# EAGLE design driver (EAGLE 6.5.0)

## Sheet 1 of 3
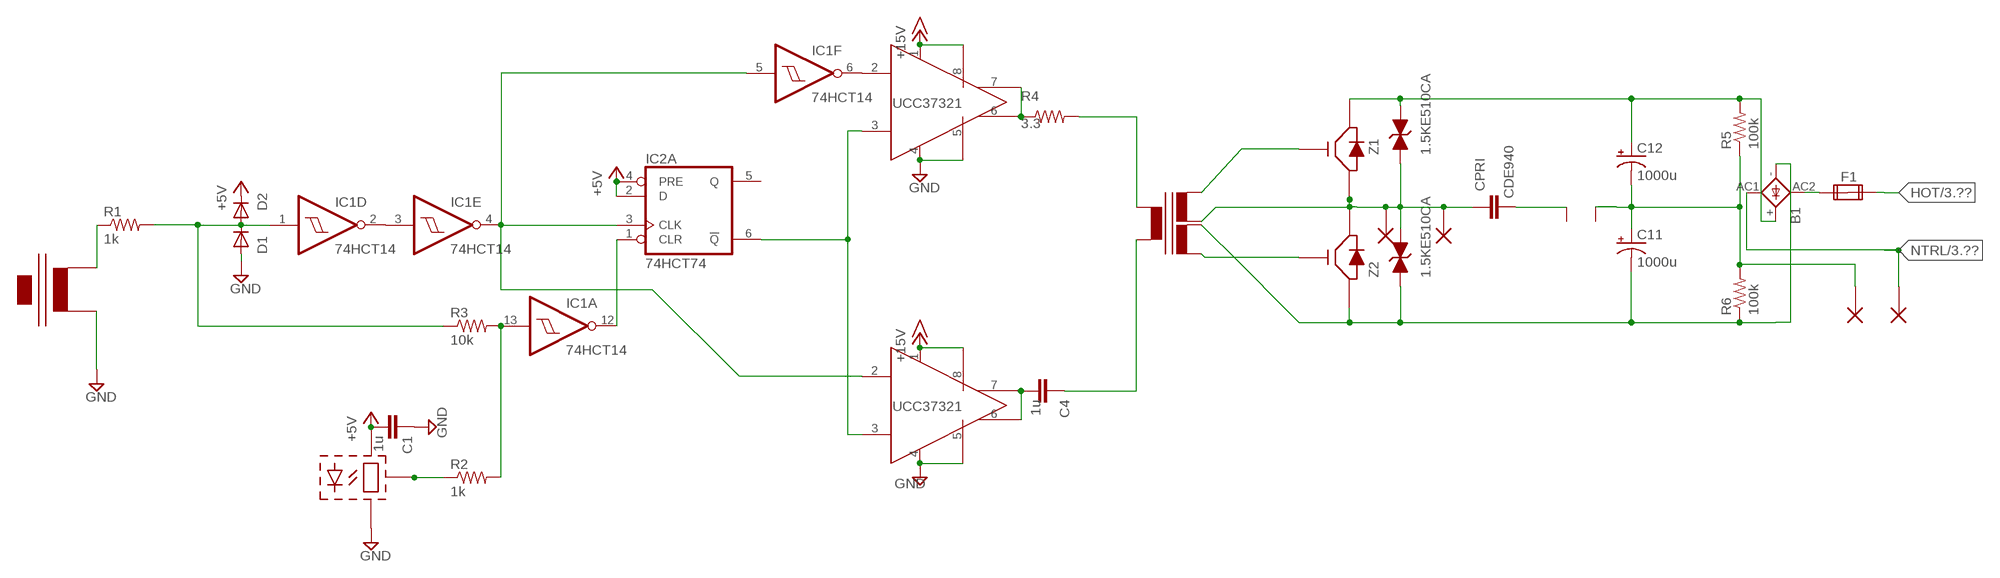
[diagram p0: schematic, sheet 1]

### Parts
B1  GBU4  [GBU4S]
C1  1u  C-EU050-024X044  [C050-024X044@1]
C4  1u  C-EU050-024X044  [C050-024X044@1]
C11  1000u  CPOL-USE10-25  [EB25D]
C12  1000u  CPOL-USE10-25  [EB25D]
CPRI  CDE940  [CDE940]
D1  1N4148DO35-7  [DO35-7]
D2  1N4148DO35-7  [DO35-7]
F1  FUSE2P  [FUSE1]
IC1  74HCT14  74LS14N  [DIL14]
IC2  74HCT74  74LS74N  [DIL14]
IC3  UCC37321DIL8  [DIL08]
IC4  UCC37321DIL8  [DIL08]
P1  12AWG_PAD  [12AWG_PAD]
P2  12AWG_PAD  [12AWG_PAD]
P3  12AWG_PAD  [12AWG_PAD]
P4  12AWG_PAD  [12AWG_PAD]
R1  1k  RES_5W  [0922/22]
R2  1k  R-US_0204/7  [0204/7]
R3  10k  R-US_0204/7  [0204/7]
R4  3.3  R-US_0204/7  [0204/7]
R5  100k  R-US_0309/10  [0309/10]
R6  100k  R-US_0309/10  [0309/10]
T1  P0584  [P0584]
U$2  TRIAD_CT  [CT2]
U$5  2STANDOFFS  [2STANDOFFS]
U$6  IF-D95  [IFD95]
U$7  FGA60N65SMD  [TO247H]
U$8  FGA60N65SMD  [TO247H]
Z1  1.5KE510CA  [DO201]
Z2  1.5KE510CA  [DO201]

### Nets
+5V: C1.2 D2.C IC2.2(A:D) IC2.4(A:PRE) U$6.V+(VCC) ; also sheet 3
+15V: IC3.1(1_VDD) IC3.8(8_VDD) IC4.1(1_VDD) IC4.8(8_VDD) ; also sheet 3
GND: C1.1 D1.A IC3.4(4_AGND) IC3.5(5_PGND) IC4.4(4_AGND) IC4.5(5_PGND) U$2.P$2 U$6.GND ; also sheet 2,3
HOT: F1.2A ; also sheet 3
N: C11.+ C12.- P3.P$1 R5.1 R6.2 U$5.P$1
N$1: R1.1 U$2.P$1
N$2: T1.7(SEC2B) U$8.G
N$3: D1.C D2.A IC1.1(D:I) R1.2 R3.1
N$4: IC1.6(F:O) IC3.2(2_IN)
N$5: IC1.2(D:O) IC1.3(E:I)
N$6: IC1.12(A:O) IC2.1(A:CLR)
N$11: IC3.6(6_OUT) IC3.7(7_OUT) R4.1
N$13: C4.2 IC4.6(6_OUT) IC4.7(7_OUT)
N$14: CPRI.P$1 P1.P$1 P2.P$1 T1.4(SEC1B) U$7.E U$8.C Z1.A Z2.C
N$15: R2.1 U$6.OUT
N$16: IC1.13(A:I) R2.2 R3.2
N$17: B1.AC2(AC1) F1.1A
N$18: T1.3(SEC1A) U$7.G
N$19: IC1.4(E:O) IC1.5(F:I) IC2.3(A:CLK) IC4.2(2_IN)
N$22: CPRI.P$2 U$5.P$2
N$23: R4.2 T1.1(PRIA)
N$24: C4.1 T1.10(PRIB)
N$25: IC2.6(A:!Q) IC3.3(3_ENBL) IC4.3(3_ENBL)
NEG: B1.- C11.- R6.1 T1.8(SEC2A) U$8.E Z2.A
NTRL: B1.AC1(AC2) P4.P$1 ; also sheet 3
POS: B1.+ C12.+ R5.2 U$7.C Z1.C
Unconnected: F1.1B F1.2B IC2.5(A:Q)

## Sheet 2 of 3
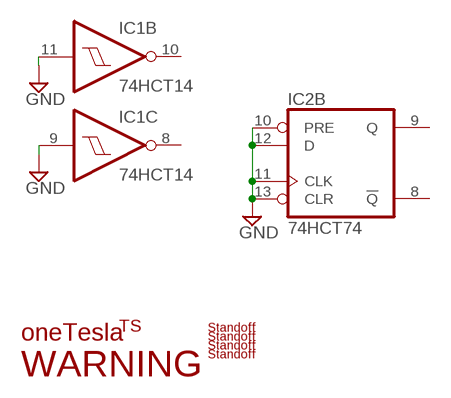
[diagram p1: schematic, sheet 2]

### Parts
U$1  LOGO  [LOGO]
U$3  WARNING  [WARNING]
U$4  TS-LOGO  [TSLOGO]
U$12  STANDOFF-QTR  [STANDOFF]
U$13  STANDOFF-QTR  [STANDOFF]
U$14  STANDOFF-QTR  [STANDOFF]
U$15  STANDOFF-QTR  [STANDOFF]

### Nets
GND: IC1.9(C:I) IC1.11(B:I) IC2.10(B:PRE) IC2.11(B:CLK) IC2.12(B:D) IC2.13(B:CLR) ; also sheet 1,3
Unconnected: IC1.8(C:O) IC1.10(B:O) IC2.8(B:!Q) IC2.9(B:Q)

## Sheet 3 of 3
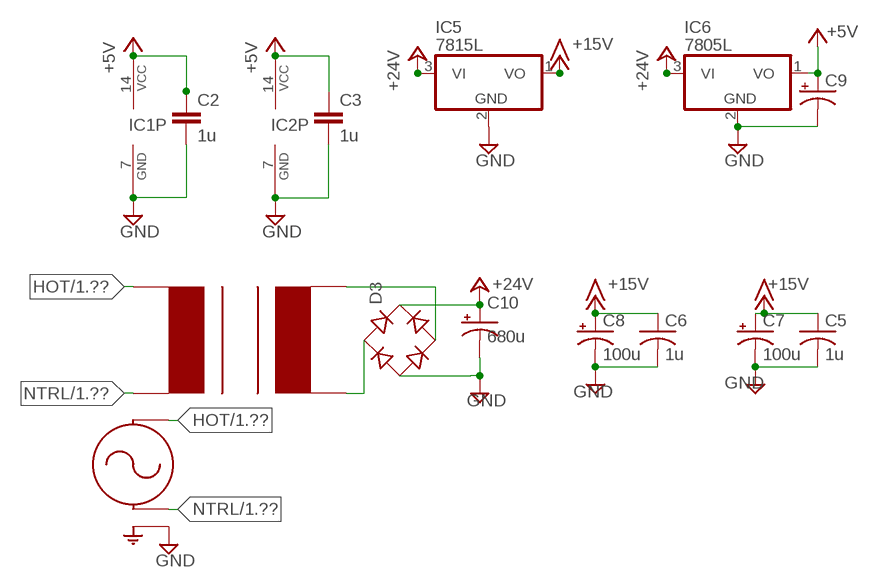
[diagram p2: schematic, sheet 3]

### Parts
C2  1u  C-EU050-024X044  [C050-024X044@1]
C3  1u  C-EU050-024X044  [C050-024X044@1]
C5  1u  C-US050-024X044  [C050-024X044]
C6  1u  C-US050-024X044  [C050-024X044]
C7  100u  CPOL-USE2.5-5  [E2,5-5]
C8  100u  CPOL-USE2.5-5  [E2,5-5]
C9  CPOL-USE2.5-5  [E2,5-5]
C10  680u  CPOL-USE3.5-8  [E3,5-8]
D3  B-DIL  [B-DIL]
IC5  7815L  [TO92]
IC6  7805L  [TO92]
U$9  EI30  EL30  [EL30]
U$10  IEC320/C6  [IEC320/C6]

### Nets
+5V: C2.1 C3.1 C9.+ IC1.14(P:VCC) IC2.14(P:VCC) IC6.1(VO) ; also sheet 1
+15V: C5.1 C6.1 C7.+ C8.+ IC5.1(VO) ; also sheet 1
+24V: C10.+ D3.+ IC5.3(VI) IC6.3(VI)
GND: C2.2 C3.2 C5.2 C6.2 C7.- C8.- C9.- C10.- D3.- IC1.7(P:GND) IC2.7(P:GND) IC5.2(GND) IC6.2(GND) U$10.G ; also sheet 1,2
HOT: U$9.1 U$10.H ; also sheet 1
N$9: D3.AC1 U$9.9
N$21: D3.AC2 U$9.7
NTRL: U$9.5 U$10.N ; also sheet 1

## Library data of the parts
B1 = rectifier:GBU4: GENERAL INSTRUMENT RECTIFIER
C1-C4 = rcl:C-EU: CAPACITOR, European symbol
C5 C6 = rcl:C-US: CAPACITOR, American symbol
C7-C12 = rcl:CPOL-US: POLARIZED CAPACITOR, American symbol
CPRI = smallcoil:CDE940
D1 D2 = diode:1N4148: DIODE high speed (Philips)
D3 = rectifier:B-DIL: RECTIFIER
F1 = special:FUSE2P: FUSE 5 x 20 mm
IC1 = 74xx-us:74*14: Hex schmitt trigger INVERTER
IC2 = 74xx-us:74*74: Dual D type positive edge triggered FLIP FLOP, preset and clear
IC3 IC4 = ucc37321:UCC37321: NonInverting 9A Mosfet Gate Diver with Enable
IC5 IC6 = linear:78*: Positive VOLTAGE REGULATOR Source: http://cache.national.com/ds/LM/LM78L05.pdf http://www.fairchildsemi.com/ds/LM/LM7805.pdf
P1-P4 = onecoil:12AWG_PAD
R1 = onecoil:RES_5W
R2-R6 = resistor:R-US_: RESISTOR, American symbol
T1 = ts:P0584: Pulse Electronics P0584 1:1:1 GDT
U$1 = onecoil:LOGO
U$2 = onecoil:TRIAD_CT
U$3 = onecoil:WARNING
U$4 = ts:TS-LOGO
U$5 = ts:2STANDOFFS
U$6 = onecoil:IF-D95
U$7 U$8 = ts:FGA60N65SMD
U$9 = utesla:EL30
U$10 = ts:IEC320/C6
U$12-U$15 = utesla:STANDOFF-QTR
Z1 Z2 = 1.5KE510CA:1.5KE510CA

## Board
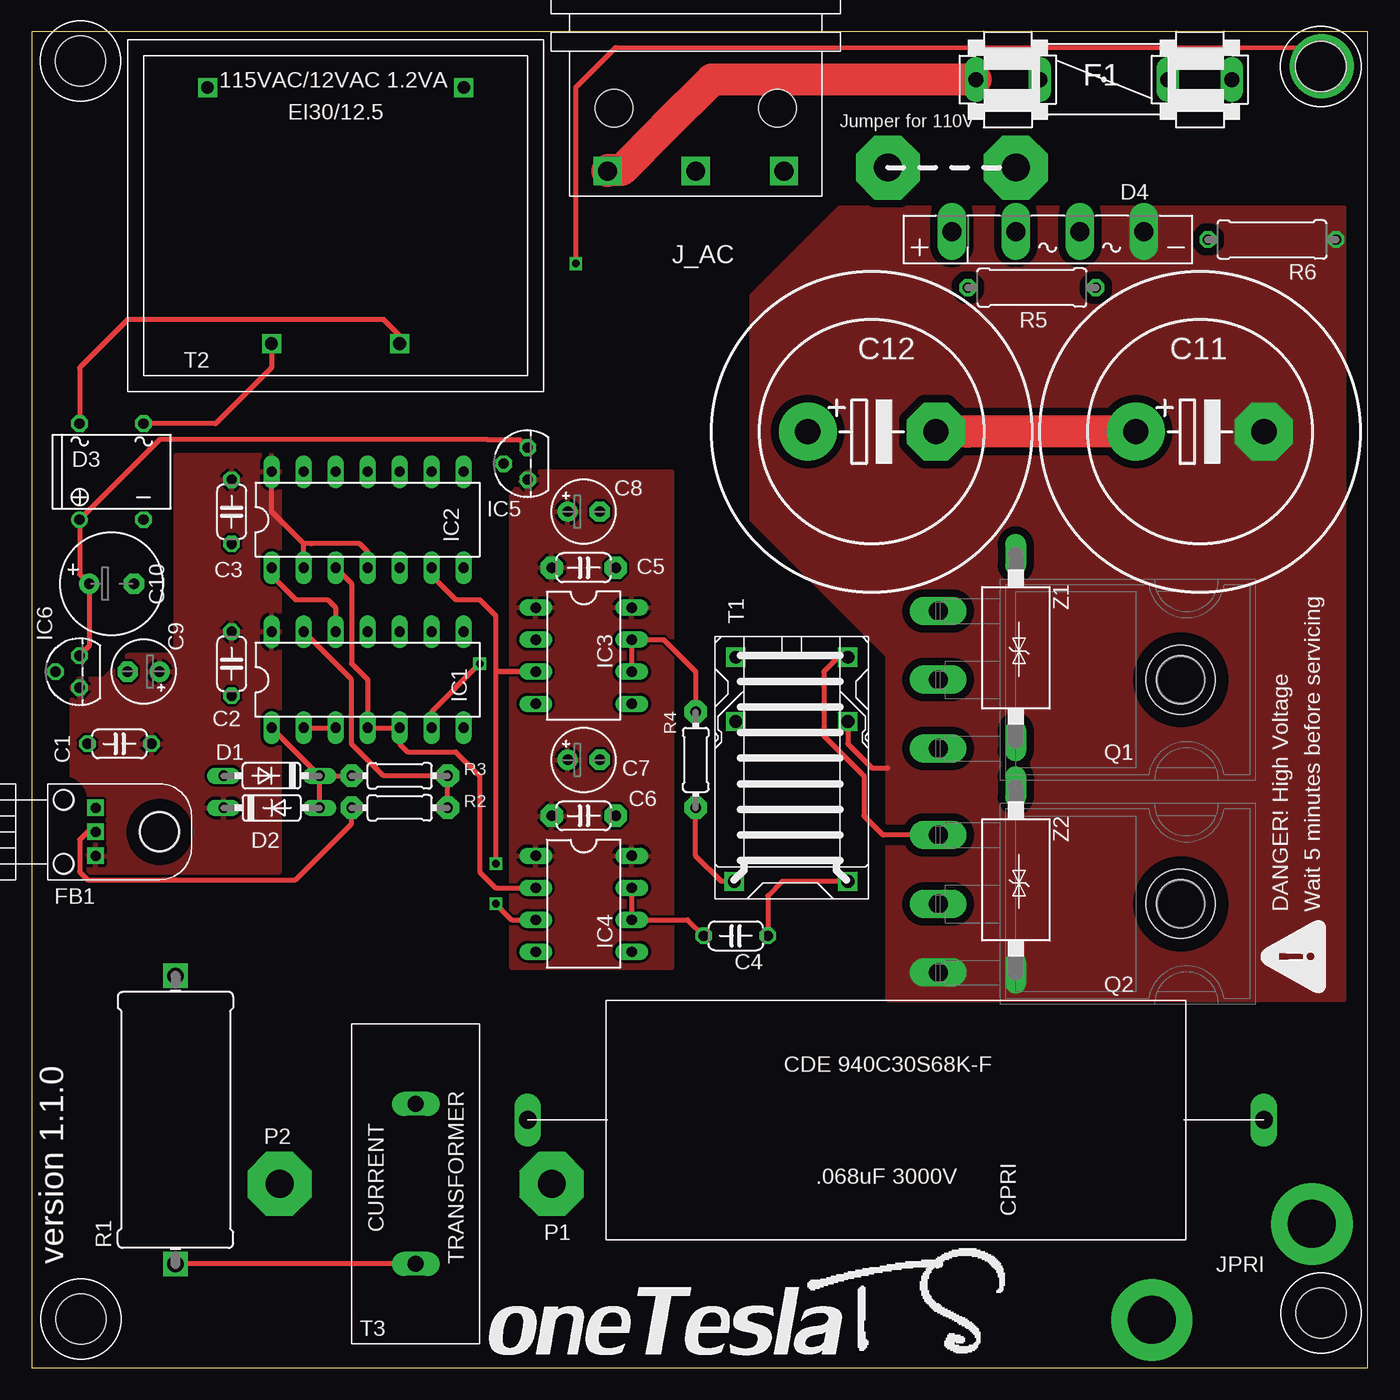
[diagram p3: board, top side]
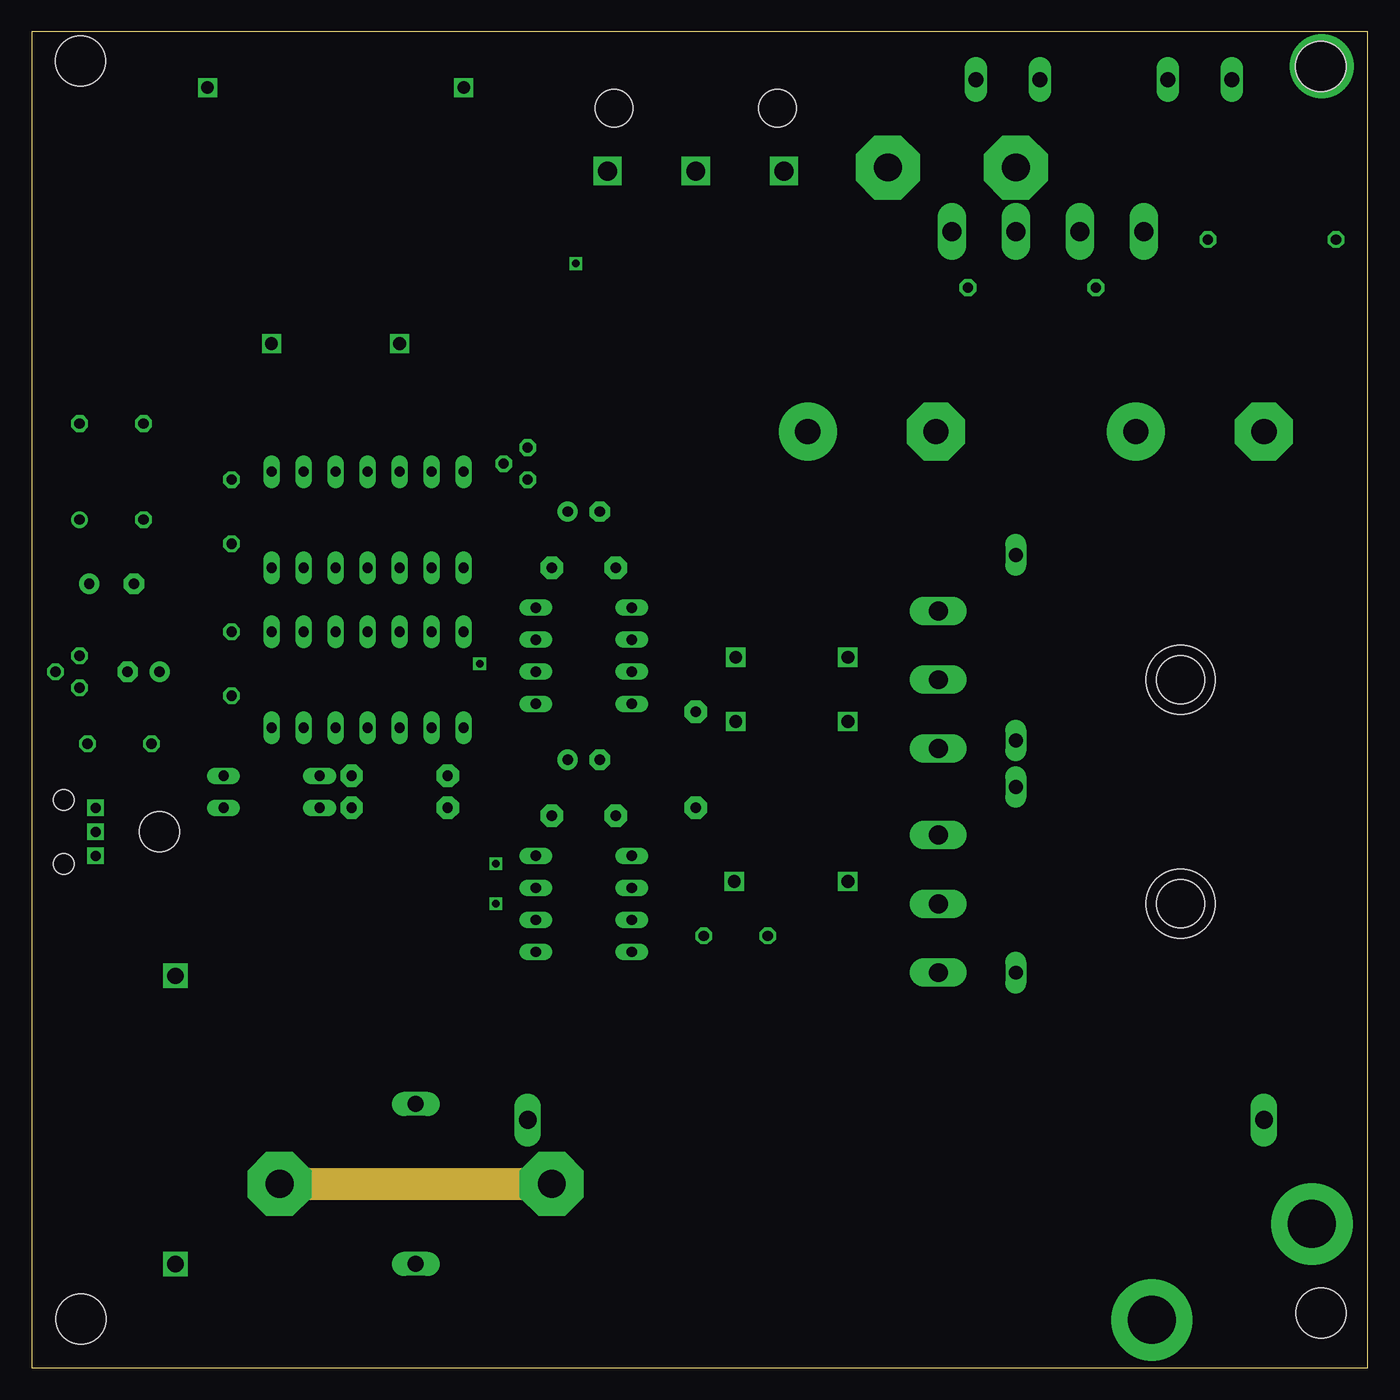
[diagram p4: board, inner layer Route2]
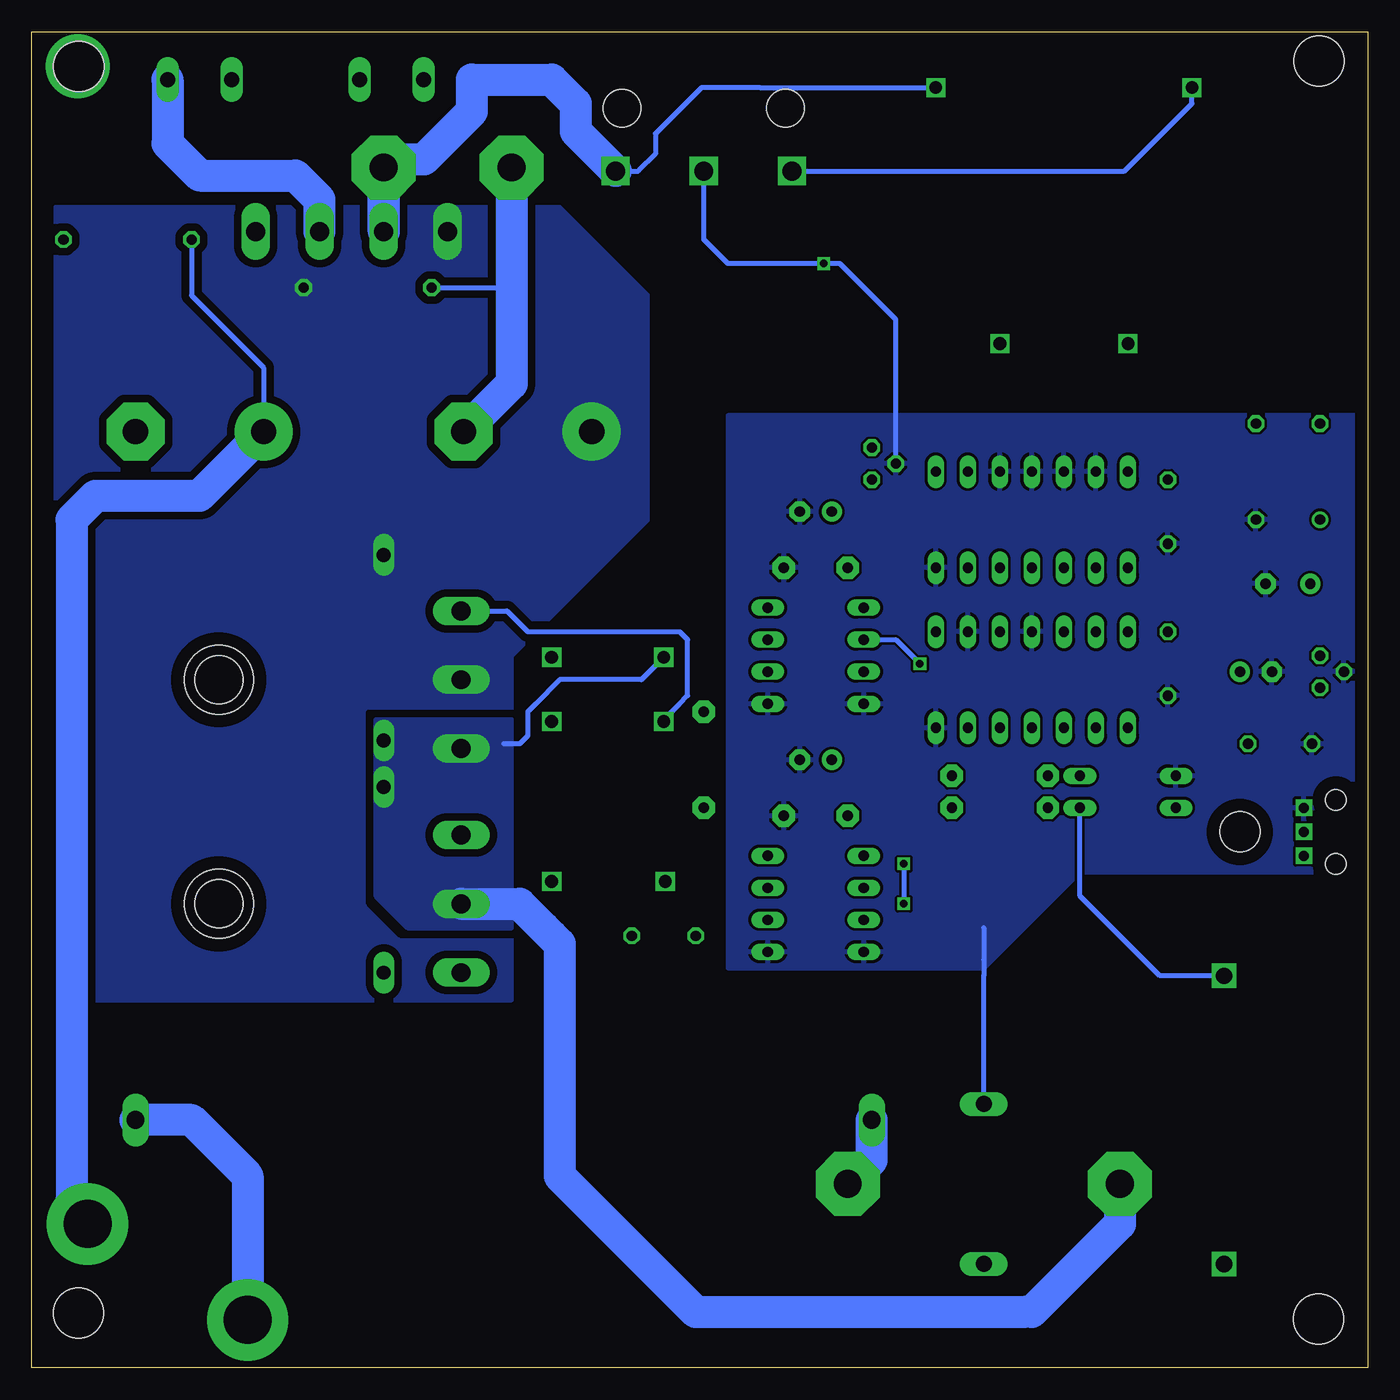
[diagram p5: board, bottom side, seen from below]

Size 106.05 x 106.05 mm. Coordinates in mm from the lower left corner, seen from the top.
Outline: 0,0 106.05,0 106.05,106.05 0,106.05 0,0
Copper layers (1*2*16): Top 0.035mm / dielectric 1.5mm / Route2 0.035mm / dielectric 0.15mm / Bottom 0.035mm
Design rules "default": minimum track width 10mil, minimum drill 24mil, track to track 8mil, track to pad 8mil, pad to pad 8mil, via to via 8mil, smd to smd 8mil, copper to edge 40mil, drill to drill 8mil, minimum pad ring 10mil, minimum via ring 8mil, stop-mask expansion 4mil, vias tented up to drill 0mil, thermal gap 10mil
Holes 5.5 mm at 91.19,36.83 91.19,54.61

### Footprints (pad centres in the part's own frame; a part is rotated, then mirrored left to right if it is on the bottom)
GBU4S = drill 1.499 long: + 7.62,0; - -7.62,0; AC1 2.54,0; AC2 -2.54,0
C050-024X044@1 = drill 0.813 octagon: 1 -2.54,0; 2 2.54,0
C050-024X044 = drill 0.813 pad 1.778 octagon: 1 -2.54,0; 2 2.54,0
E2,5-5 = drill 0.813 pad 1.6: + -1.27,0 | drill 0.813 pad 1.6 octagon: - 1.27,0
E3,5-8 = drill 0.813 pad 1.6: + -1.778,0 | drill 0.813 pad 1.6 octagon: - 1.778,0
EB25D = drill 2.007 pad 4.597: + -5.08,0 | drill 2.007 pad 4.597 octagon: - 5.08,0
CDE940 = drill 1.4 long: P$1 -29.21,0; P$2 29.21,0
DO35-7 = drill 0.813 long: A 3.81,0; C -3.81,0
B-DIL = drill 0.813: + -2.54,-3.81 | drill 0.813 octagon: - 2.54,-3.81; AC1 2.54,3.81; AC2 -2.54,3.81
FUSE1 = drill 1.194 long: 1A -10.16,0; 1B -5.08,0; 2A 10.16,0; 2B 5.08,0
DIL14 = drill 0.813 long: 1 -7.62,-3.81; 2 -5.08,-3.81; 3 -2.54,-3.81; 4 0,-3.81; 5 2.54,-3.81; 6 5.08,-3.81; 7 7.62,-3.81; 8 7.62,3.81; 9 5.08,3.81; 10 2.54,3.81; 11 0,3.81; 12 -2.54,3.81; 13 -5.08,3.81; 14 -7.62,3.81
DIL08 = drill 0.813 long: 1 -3.81,-3.81; 2 -1.27,-3.81; 3 1.27,-3.81; 4 3.81,-3.81; 5 3.81,3.81; 6 1.27,3.81; 7 -1.27,3.81; 8 -3.81,3.81
TO92 = drill 0.813 octagon: 1 -1.27,0; 2 0,1.905; 3 1.27,0
12AWG_PAD = drill 2.2 pad 5.08 octagon: P$1 0,0
0922/22 = drill 1.3 square: 1 -11.43,0; 2 11.43,0
0204/7 = drill 0.813 pad 1.778 octagon: 1 -3.81,0; 2 3.81,0
0309/10 = drill 0.813 octagon: 1 -5.08,0; 2 5.08,0
P0584 = drill 1.016 square: 1 -9.017,4.572; 3 3.683,4.445; 4 8.763,4.445; 7 8.763,-4.445; 8 3.683,-4.445; 10 -9.017,-4.445
CT2 = drill 1.27 long: P$1 -6.35,0; P$2 6.35,0
2STANDOFFS = drill 3.81 pad 6.452: P$1 4.445,2.54; P$2 -8.255,-5.08
IFD95 = drill 0.8 square: GND 1.905,5.08; OUT 0,5.08; V+ -1.905,5.08 | hole 1.651: -2.54,7.62; 2.54,7.62 | hole 3.2: 0,0
TO247H = drill 1.499 long: C 15.05,0; E 15.05,5.461; G 15.05,-5.461 | hole 3.81: -4.181,0
EL30 = drill 1 square: 1 10.16,-10.16; 5 -10.16,-10.16; 7 -5.08,10.16; 9 5.08,10.16
IEC320/C6 = drill 1.5 square: G 0,-14.5; H -7,-14.5; N 7,-14.5 | hole 3: -6.5,-9.5; 6.5,-9.5
STANDOFF = hole 4: 0,0
DO201 = drill 1.1 long: A 7.366,0; C -7.366,0

### Placement (x,y rotation side)
B1  80.64,90.17 180 top
C1  6.99,49.53 0 top
C2  15.88,55.88 270 top
C3  15.88,67.94 270 top
C4  55.88,34.29 180 top
C5  43.81,63.5 0 top
C6  43.81,43.81 0 top
C7  43.81,48.26 0 top
C8  43.81,67.94 0 top
C9  8.89,55.24 180 top
C10  6.35,62.23 0 top
C11  92.71,74.3 0 top
C12  66.67,74.3 0 top
CPRI  68.58,19.68 0 top
D1  19.05,46.99 180 top
D2  19.05,44.45 0 top
D3  6.35,71.12 0 top
F1  85.09,102.23 180 top
IC1  26.67,54.61 0 top
IC2  26.67,67.31 0 top
IC3  43.81,56.52 270 top
IC4  43.81,36.83 270 top
IC5  39.37,71.75 90 top
IC6  3.81,55.24 90 top
P1  19.68,14.61 90 top
P2  41.27,14.61 90 top
P3  67.94,95.25 0 top
P4  78.11,95.25 0 top
R1  11.43,19.68 90 top
R2  29.21,44.45 0 top
R3  29.21,46.99 0 top
R4  52.7,48.26 270 top
R5  79.38,85.72 0 top
R6  98.42,89.53 180 top
T1  60.33,47.62 90 top
U$1  35.56,0 0 top
U$2  30.48,14.61 90 top
U$3  105.41,26.04 90 top
U$4  60.96,0.64 0 top
U$5  97.16,8.89 0 top
U$6  10.16,42.55 90 top
U$7  87,54.61 180 top
U$8  87,36.83 180 top
U$9  24.13,91.44 180 top
U$10  52.7,109.47 0 top
U$12  3.87,103.7 0 top
U$13  102.3,103.26 0 top
U$14  3.92,3.89 0 top
U$15  102.32,4.37 0 top
Z1  78.11,57.15 270 top
Z2  78.11,38.73 270 top

### Tracks (layer width: path | path; a pad name or v marks a point on that pad's centre or on a via)
+5V
  Top 0.406: IC2.4 26.67,64.77 26.04,65.41 22.23,65.41 21.59,65.41 | 21.59,64.77 IC2.2 21.59,65.41 | 21.59,65.41 19.05,67.94 IC2.14
  pour Top: 3.17,54.61 3.17,39.37 19.68,39.37 19.68,72.39 11.43,72.39 11.43,57.15 10.79,56.52 7.62,56.52 5.71,54.61
+15V
  pour Top: 39.37,71.12 50.8,71.12 50.8,31.75 38.1,31.75 38.1,69.22
+24V
  Top 0.406: IC5.3 38.73,73.66 36.2,73.66 10.16,73.66 D3.+ 3.81,62.99 C10.+ 4.57,57.28 IC6.3
GND  (via drill 0.6, 3.2 pad 5.08)
  Top 0.406: v102.36,103.29 100.75,104.74 46.35,104.78 43.18,101.6 v43.18,87.63
  Bottom 0.406: IC5.2 37.47,83.19 41.91,87.63 v43.18,87.63 48.26,87.63 50.8,87.63 52.7,89.53 U$10.G | 30.48,34.92 30.48,32.38 30.48,31.11 U$2.P$2
  pour Bottom: 0.64,75.56 50.8,75.56 50.8,31.75 30.48,31.75 22.86,39.37 1.27,39.37
HOT
  Top 2.54: F1.2A 53.98,102.23 50.16,98.42 50.16,98.41 46.8,95.05 45.78,95.05 U$10.H
  Bottom 0.406: U$9.1 13.97,100.33 19.33,94.97 U$10.H
N
  Top 2.54: C11.+ 74.3,74.3 C12.-
  Bottom 0.406: R6.2 93.34,85.09 87.63,79.38 C11.+ | R5.1 67.94,85.72
  Bottom 2.54: C11.+ 92.71,69.22 100.97,69.22 102.87,67.31 102.87,13.34 102.87,12.7 U$5.P$1 | C12.- 67.94,78.11 67.94,85.72 67.94,93.98 P3.P$1
N$1
  Top 0.406: U$2.P$1 R1.1
N$2
  Top 0.406: T1.7 64.01,56.39 62.87,55.24 62.87,50.16 66.04,46.99 66.04,43.81 67.31,42.55 67.56,42.29 U$8.G
N$3
  Top 0.406: D2.A D1.C | D1.C 24.13,46.99 R3.1 | D1.C IC1.1
  Bottom 0.406: D2.A 22.86,37.47 20.32,34.92 16.51,31.11 R1.2
N$4  (via drill 0.6)
  Top 0.406: v35.56,55.88 31.75,52.07 IC1.6
  Bottom 0.406: IC3.2 37.47,57.78 v35.56,55.88
N$5
  Top 0.406: IC1.2 IC1.3
N$6
  Top 0.406: IC2.1 19.05,62.87 20.95,60.96 23.5,60.96 24.13,60.33 IC1.12
N$9
  Top 0.406: U$9.9 19.05,79.38 14.61,74.93 D3.AC1
N$11
  Top 0.406: IC3.6 IC3.7 50.16,57.78 52.7,55.24 R4.1
N$13
  Top 0.406: IC4.7 IC4.6 52.07,35.56 C4.2
N$14
  Route2 2.54: P1.P$1 P2.P$1
  Bottom 0.406: U$7.E 71.5,49.15 | T1.4 57.66,54.61 64.14,54.61 66.04,52.7 66.67,52.07 66.67,50.16 67.31,49.53 68.58,49.53
  Bottom 2.54: P2.P$1 39.37,16.51 CPRI.P$1 | P1.P$1 19.68,11.43 26.67,4.45 27.3,4.45 27.94,4.45 32.38,4.45 53.34,4.45 64.14,15.24 64.14,33.66 64.77,34.29 65.41,34.92 67.31,36.83 U$8.C
  pour Bottom (isolate 0.61, no thermals): 67.94,51.44 78.74,51.44 78.74,37.47 76.2,34.92 67.94,34.92
N$15
  Top 0.406: R2.1 25.4,43.18 22.86,40.64 20.95,38.73 4.45,38.73 3.81,39.37 3.81,41.91 4.45,42.55 U$6.OUT
N$16
  Top 0.406: R2.2 R3.2 27.94,46.99 25.4,49.53 25.4,54.61 IC1.13
N$17
  Bottom 2.54: F1.1A 95.25,97.16 92.71,94.61 85.09,94.61 83.19,92.71 B1.AC2
N$18
  Bottom 0.406: T1.3 55.88,51.44 54.61,52.7 53.98,53.34 53.98,57.78 54.61,58.42 66.67,58.42 68.33,60.07 U$7.G
N$19
  Top 0.406: IC2.3 25.4,62.23 25.4,55.88 26.67,54.61 26.67,52.7 IC1.4 IC1.5 29.21,49.53 29.84,48.9 33.66,48.9 35.56,46.99 35.56,39.37 36.83,38.1 IC4.2
N$21
  Top 0.406: U$9.7 29.21,81.92 27.94,83.19 7.62,83.19 3.81,79.38 D3.AC2
N$22
  Bottom 2.54: CPRI.P$2 93.34,19.68 88.9,15.24 U$5.P$2
N$23
  Top 0.406: T1.1 54.74,38.61 52.7,40.64 R4.2
N$24
  Top 0.406: T1.10 59.56,38.61 58.42,37.47 C4.1
N$25  (via drill 0.6)
  Top 0.406: IC2.6 31.75,62.87 33.66,60.96 35.56,60.96 36.83,59.69 36.83,55.88 36.83,55.24 | 36.83,55.24 IC3.3 36.83,55.24 | 36.83,55.24 v36.83,40.01 | v36.83,36.83 38.1,35.56 IC4.3
  Bottom 0.406: v36.83,40.01 v36.83,36.83
NEG
  Top 0.406: T1.8 64.77,49.53 66.67,47.62 67.94,47.62
  pour Top (isolate 0.61, rank 2, no thermals): 64.14,92.08 104.14,92.08 104.14,29.21 67.94,29.21 67.94,56.52 57.15,67.31 57.15,85.09
NTRL
  Bottom 0.406: U$9.5 48.26,101.6 52.88,101.6 56.54,97.94 56.54,96.33 57.82,95.05 57.9,94.97 U$10.N
  Bottom 2.54: P4.P$1 B1.AC1 P4.P$1 | P4.P$1 77.47,95.89 | U$10.N 62.87,98.12 62.87,100.33 64.77,102.23 71.12,102.23 71.12,99.69 74.93,95.89 77.47,95.89 | 77.47,95.89 P4.P$1
POS
  pour Bottom (isolate 0.61, rank 2, no thermals): 57.15,85.09 64.14,92.08 104.14,92.08 104.14,29.21 67.94,29.21 67.94,56.52 57.15,67.31

### Text on the board
tPlace: Jumper for 110V | J_AC
tNames: D4 | T2 | T1 | Q1 | FB1 | Q2 | P2 | CPRI | P1 | version 1.1.0 | JPRI | T3
tDocu: Replace with 250V 10A fuse only | J110